# Altium schematic sheet 2_ADSTM32-MCU.SchDoc
size A; SheetNumber: 3; SheetTotal: 4
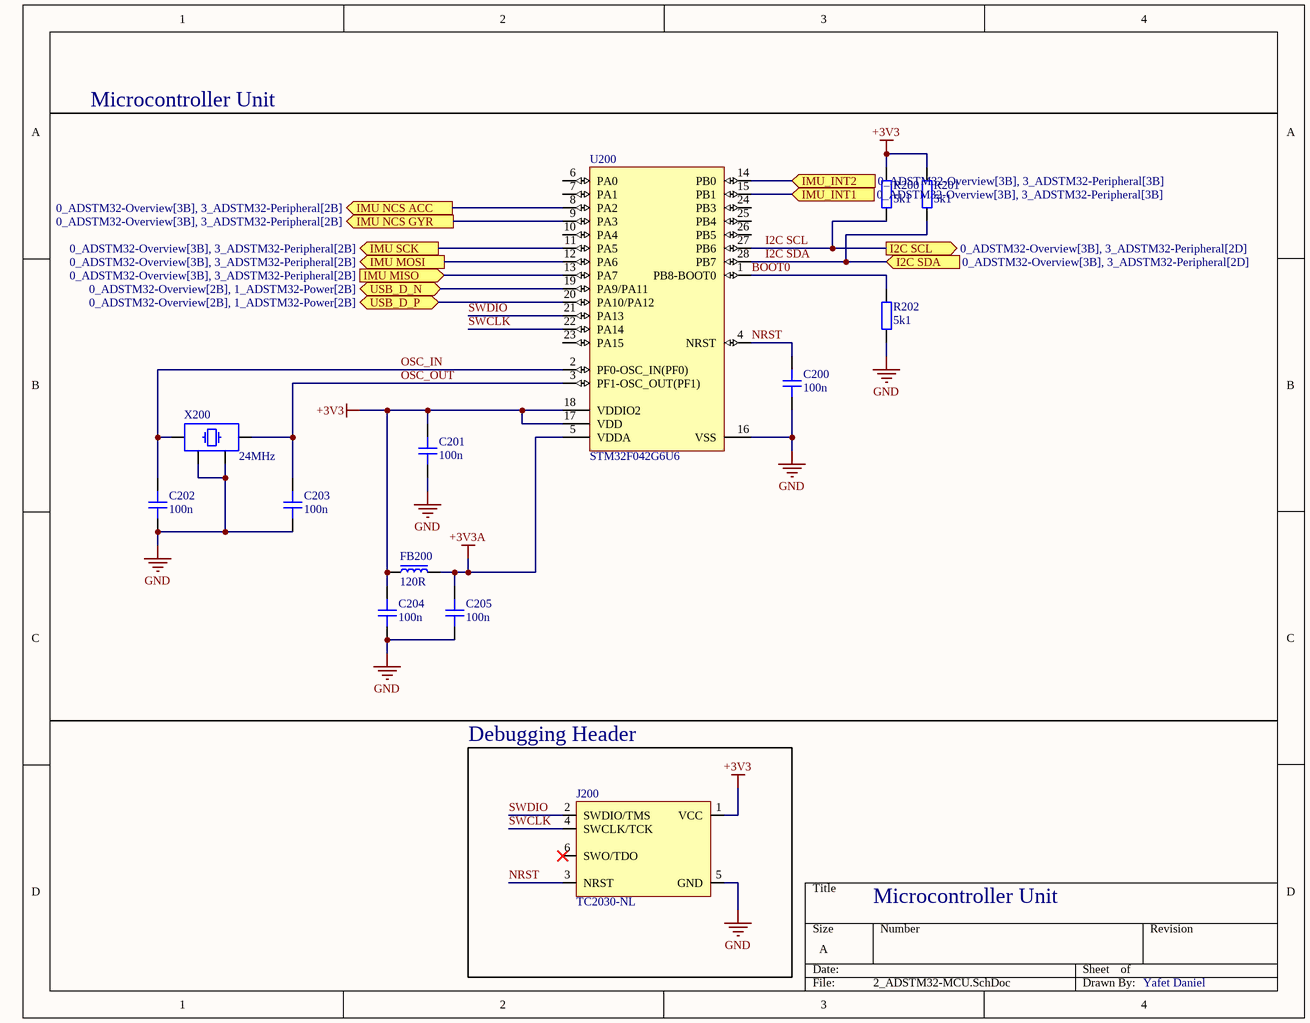
[diagram p0: 2_ADSTM32-MCU.SchDoc]

## Parts
C200  100n  [CAP_0603]
C201  100n  [CAP_0603]
C202  100n  [CAP_0603]
C203  100n  [CAP_0603]
C204  100n  [CAP_0603]
C205  100n  [CAP_0603]
FB200  120R  [FB_0402]
J200  TC2030-NL  [TC2030-NL-FP]  (no BOM)
R200  5k1  [RES_0603]
R201  5k1  [RES_0603]
R202  5k1  [RES_0603]
U200  STM32F042G6U6  [STM-UFQFPN28_V]
X200  24MHz  [XTAL_3225]

## Blocks framed on the sheet
Debugging Header: J200

## Ports
I2C SCL (out, see 0_ADSTM32-Overview[3B], 3_ADSTM32-Peripheral[2D]), I2C SDA (in, see 0_ADSTM32-Overview[3B], 3_ADSTM32-Peripheral[2D]), IMU MISO (in, see 0_ADSTM32-Overview[3B], 3_ADSTM32-Peripheral[2B]), IMU MOSI (out, see 0_ADSTM32-Overview[3B], 3_ADSTM32-Peripheral[2B]), IMU NCS ACC (out, see 0_ADSTM32-Overview[3B], 3_ADSTM32-Peripheral[2B]), IMU NCS GYR (out, see 0_ADSTM32-Overview[3B], 3_ADSTM32-Peripheral[2B]), IMU SCK (out, see 0_ADSTM32-Overview[3B], 3_ADSTM32-Peripheral[2B]), IMU_INT1 (in, see 0_ADSTM32-Overview[3B], 3_ADSTM32-Peripheral[3B]), IMU_INT2 (in, see 0_ADSTM32-Overview[3B], 3_ADSTM32-Peripheral[3B]), USB_D_N (bidir, see 0_ADSTM32-Overview[2B], 1_ADSTM32-Power[2B]), USB_D_P (bidir, see 0_ADSTM32-Overview[2B], 1_ADSTM32-Power[2B])

## Nets
+3V3: C201.2 C204.2 FB200.1 J200.1(VCC) R200.2 R201.2 U200.17(VDD) U200.18(VDDIO2)
+3V3A: C205.2 FB200.2 U200.5(VDDA)
GND: C200.1 C201.1 C202.1 C203.1 C204.1 C205.1 J200.5(GND) R202.1 U200.16(VSS) X200.2 X200.4
BOOT0: R202.2 U200.1(PB8-BOOT0)
I2C SCL: R200.1 U200.27(PB6) ; port I2C SCL
I2C SDA: R201.1 U200.28(PB7) ; port I2C SDA
IMU MISO: U200.13(PA7) ; port IMU MISO
IMU MOSI: U200.12(PA6) ; port IMU MOSI
IMU NCS ACC: U200.8(PA2) ; port IMU NCS ACC
IMU NCS GYR: U200.9(PA3) ; port IMU NCS GYR
IMU SCK: U200.11(PA5) ; port IMU SCK
IMU_INT1: U200.15(PB1) ; port IMU_INT1
IMU_INT2: U200.14(PB0) ; port IMU_INT2
NRST: C200.2 J200.3(NRST) U200.4(NRST)
OSC_IN: C202.2 U200.2(PF0-OSC_IN(PF0)) X200.1
OSC_OUT: C203.2 U200.3(PF1-OSC_OUT(PF1)) X200.3
SWCLK: J200.4(SWCLK/TCK) U200.22(PA14)
SWDIO: J200.2(SWDIO/TMS) U200.21(PA13)
USB_D_N: U200.19(PA9/PA11) ; port USB_D_N
USB_D_P: U200.20(PA10/PA12) ; port USB_D_P

Not connected (* = marked no-connect by the designer): J200 6(SWO/TDO)*; U200 6(PA0) 7(PA1) 10(PA4) 23(PA15) 24(PB3) 25(PB4) 26(PB5)

## Notes on the sheet
- Microcontroller Unit
- Yafet Daniel

## Library data of the parts
C200-C205 = CAP_0603: Capacitor SMD 0603; Manufacturer: *; Manufacturer Part Number: *; Distributor Link: *; LCSC: *; Rating: *; Dielectric: *
FB200 = FB_0402: Ferrite Bead SMD 0402; Manufacturer: *; Manufacturer Part Number: *; Distributor Link: *; LCSC: *
J200 = TC2030-NL: Tag-Connect No-Solder SWD Debug Connector (No Legs) DO NOT PLACE; Manufacturer: Tag-Connect; Manufacturer Part Number: TC2030-NL-FP
R200-R202 = RES_0603: Resistor SMD 0603; Manufacturer: *; Manufacturer Part Number: *; Distributor Link: *; LCSC: *
U200 = CMP-0304-00112-2: ARM Cortex-M0 32-bit MCU, 32 KB Flash, 6 KB Internal RAM, 24 I/Os, 28-Pin UFQFPN, -40 to 85 degC, Tray; Manufacturer: STMicroelectronics; FLASH Size (Prog) (kB): 32; I/Os (High Current): 24; Internal RAM Size (kB): 6; Supply Voltage(Vcc) min (V): 2; Operating Frequency(F) (Processor speed) (MHz): 48; Current Consumption: 0.025; Power Consumption: 0.0763; Core: ARM Cortex-M0; PartNumber: STM32F042G6U6; Packing: Tray; Package Description: 28-Pin Ultra Thin Fine Pitch Quad Flat No-Lead, 4 x 4 x 0.6 mm Body, 0.5 mm Pitch; ComponentLink2Description: Datasheet; ComponentLink1Description: Manufacturer URL; Package Reference: UFQFPN28; DatasheetVersion: Rev. 5; ComponentLink1URL: http://www.st.com/; ComponentLink2URL: http://www.st.com/st-web-ui/static/active/en/resource/technical/document/datasheet/DM00105814.pdf; Mounting Technology: Surface Mount
X200 = TSX-3225_24.0000MF15X-AC: Crystal SMD 24MHz 10PPM 7pF 3225; Manufacturer: Epson; Manufacturer Part Number: TSX-3225 24.0000MF15X-AC